# Altium schematic sheet IMU_LSM6DSOTR.SchDoc: IMU LSM6DSOTR
size 431 x 279 mm; Date: 02/15/2021; DrawnBy: Team KOIN; Organization: University of Pennsylvania; DocumentNumber: 8; Revision: 2; SheetNumber: 3; SheetTotal: 8
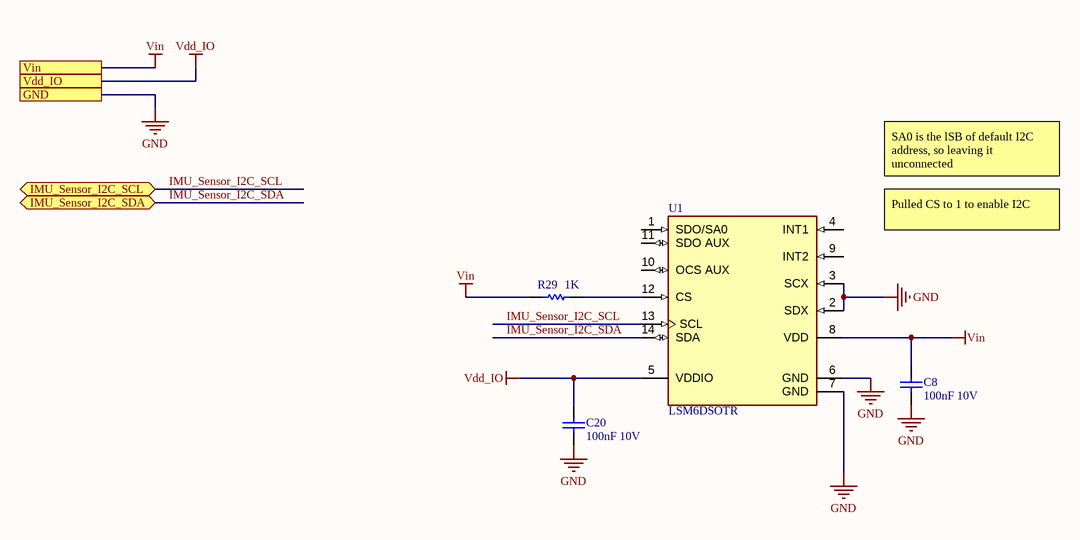
[diagram p0: IMU_LSM6DSOTR.SchDoc]

## Parts
C8  100nF 10V  [CAPC0402(1005)60_L]
C20  100nF 10V  [CAPC0402(1005)60_L]
R29  1K  [RESC0603(1608)_M]
U1  LSM6DSOTR  [FP-LGA-14L-DM00249496-MFG]

## Ports
GND, IMU_Sensor_I2C_SCL (bidir), IMU_Sensor_I2C_SDA (bidir), Vdd_IO, Vin

## Nets
GND: C8.2 C20.2 U1.2(SDX) U1.3(SCX) U1.6(GND) U1.7(GND) ; port GND
Vdd_IO: C20.1 U1.5(VDDIO) ; port Vdd_IO
Vin: C8.1 R29.1 U1.8(VDD) ; port Vin
IMU_Sensor_I2C_SCL: U1.13(SCL) ; port IMU_Sensor_I2C_SCL
IMU_Sensor_I2C_SDA: U1.14(SDA) ; port IMU_Sensor_I2C_SDA
NetR29_2: R29.2 U1.12(CS)

Not connected (* = marked no-connect by the designer): U1 1(SDO/SA0) 4(INT1) 9(INT2) 10(OCS_AUX) 11(SDO_AUX)

## Notes on the sheet
- SA0 is the lSB of default I2C address, so leaving it unconnected
- Pulled CS to 1 to enable I2C
- DWG. NO.
- REV.
- SHT.
- THIS DOCUMENT AND THE DATA DISCLOSED HEREIN OR HEREWITH IS THE PROPERTY OF ALTIUM LIMITED AND MAY BE FREELY DISTRIBUTED IN WHOLE. NO RIGHTS ARE RESERVED OR EXPRESS OR IMPLIED WARANTEE GIVEN.
- REVISION
- DESCRIPTION
- DATE
- APPROVED
- ENG:
- APPROVALS
- PROJECT
- DSN:
- CHK:
- REFERENCE DOCUMENTS
- PROJECT REVISION:
- TITLE
- DOCUMENT REVISION:
- DESIGN ITEM:
- BOM:
- FAB DWG:
- PCB DWG:
- ASSY DWG:
- SCALE:
- SIZE
- B
- CAGE CODE
- FILE NAME
- DWG NO.
- SHEET
- OF
- REV

## Library data of the parts
C8 C20 = CMP-1034-02064-1: CAP 100nF 10V ±5% 0402 (1005 Metric) Thickness 0.6mm SMD; Tolerance: Â±5%; Case-EIA: 0402; Case-Metric: 1005; Max Thickness: 0.6 mm; Value: 100nF; Rated Voltage: 10 V; Technology: SMT
R29 = CMP-1012-00510-1: 1K 0.1W 1% 0603 (1608 Metric)  SMD; Case-Metric: 1608; Case-EIA: 0603; Value: 1000.00 Ohm; Technology: SMT; Tolerance: 1 %; Power: 0.1 W
U1 = CMP-12177-000012-1: CONSUMER MEMS; Manufacturer: STMicroelectronics; Gyro Range: 125/250/500/1000/2000°/s; Max Supply Voltage: 3.6V; Sensor Output: I2C,SPI; Operating Supply Current: 0.55mA; Accel Range: 2/4/8/16g; Min Supply Voltage: 1.62V; Sensor Type: Temperature,Accelerometer,Gyroscope; Height: 0.86mm; Automotive: No; Device Class L3: Inertial Measurement Units (IMUs); Device Class L1: Sensors; ComponentLink2Description: Datasheet; Device Class L2: Motion Sensors; Temperature: -40°C to +85°C; Package: LGA-14L-DM00249496; Octopart: https://octopart.com/lsm6dsotr-stmicroelectronics-81706672; Temperature Range Low: -40°C; Digikey Description: CONSUMER MEMS; ComponentLink2URL: https://www.st.com/resource/en/datasheet/lsm6dso.pdf; Manufacturer Part Number: LSM6DSOTR; Mouser Description: iNEMO inertial module: "always-on" integrated 3D accelerometer and 3D gyroscope; Footprint Url: https://www.st.com/content/ccc/resource/technical/document/technical_note/73/17/9c/16/dd/96/4a/01/CD00134799.pdf/files/CD00134799.pdf/jcr:content/translations/en.CD00134799.pdf; Lead Free: Yes; RoHS: TRUE; Category: IC; Temperature Range High: +85°C